# Altium schematic sheet PDC_high_Current_Outputs.SchDoc
size A
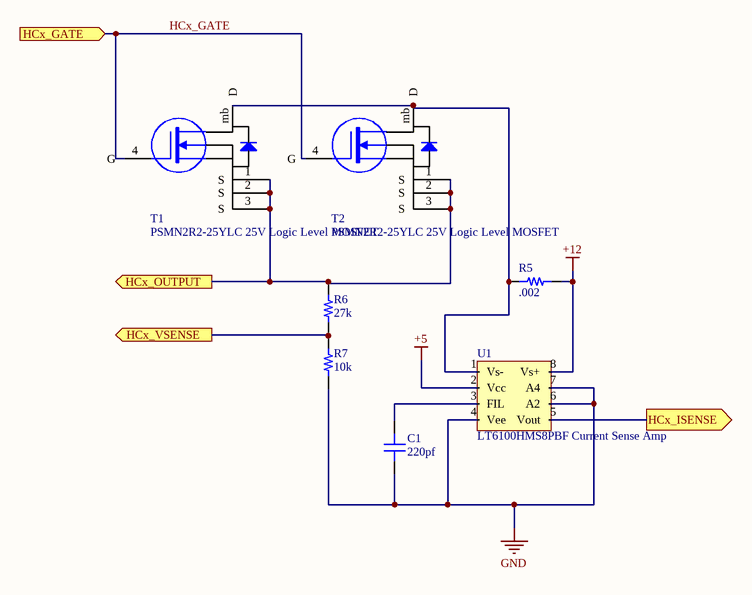
[diagram p0: PDC_high_Current_Outputs.SchDoc]

## Parts
C1  value 220pf  [CAP 0402/1005]  (hidden comment: Capacitor MLCC 220pf 16V CAP 0402/1005)
R5  value .002  [RES 2010/5025]  (hidden comment: Resistor .002 2010 1.5W 1%)
R6  value 27k  [RES 0805/2012]  (hidden comment: Resistor 27k 0805 1/10W 10%)
R7  value 10k  [RES 0402/1005]  (hidden comment: Resistor 10k 0402 1/10W 1%)
T1  PSMN2R2-25YLC 25V Logic Level MOSFET  [LFPAK-SO8]
T2  PSMN2R2-25YLC 25V Logic Level MOSFET  [LFPAK-SO8]
U1  LT6100HMS8PBF Current Sense Amp  [MSOP-8]

## Ports
HCx_GATE (in), HCx_ISENSE (out), HCx_OUTPUT (out), HCx_VSENSE (out)

## Nets
+5: U1.2(Vcc)
+12: R5.2 U1.8(Vs+)
GND: C1.1 R7.1 U1.4(Vee) U1.6(A2) U1.7(A4)
HCx_GATE: T1.4(G) T2.4(G) ; port HCx_GATE
HCx_ISENSE: U1.5(Vout) ; port HCx_ISENSE
HCx_OUTPUT: R6.2 T1.1(S) T1.2(S) T1.3(S) T2.1(S) T2.2(S) T2.3(S) ; port HCx_OUTPUT
HCx_VSENSE: R6.1 R7.2 ; port HCx_VSENSE
NetC1_2: C1.2 U1.3(FIL)
NetR5_1: R5.1 T1.mb(D) T2.mb(D) U1.1(Vs-)

## Library data of the parts
C1 = 57: Manufacturer_id: 1; idCapacitor: 57; Name: Cap_220pf_16V_CAP 0402/1005; Dielectric: Ceramic; Created_By: Nick Mah; Drawer_id: 1; Voltage_Rating: 16V; Package: CAP 0402/1005; Created_Date: 10/20/2018
R5 = 2702: Current Sense Resistor; Manufacturer_id: 1; MfrPartNo: CSNL2010FT2L00; idResistor: 2702; Name: Res_.002_2010_1.5W_1%; Created_By: Angel; Supplier 1: Digi-Key; Supplier Part Number 1: Digi-Key; Drawer_id: 1; Tolerance: 1%; Power: 1.5W; Package: 2010; Link: https://www.digikey.com/product-detail/en/stackpole-electronics-inc/CSNL2010FT2L00/CSNL2010FT2L00CT-ND/1788126; ComponentLink1Description: Datasheet
R6 = 2430: Manufacturer_id: 1; idResistor: 2430; Name: Res_27k_0805_1/10W_10%; Created_By: Nick Mah; Supplier 1: Digi-Key; Drawer_id: 1; Tolerance: 10%; Power: 1/10W; Package: 0805; ComponentLink1Description: Datasheet; Created_Date: 2018-10-20
R7 = 97: Manufacturer_id: 1; idResistor: 97; Name: Res_10k_0402_1/10W_1%; Created_By: Nick Mah; Supplier 1: Digi-Key; Drawer_id: 1; Tolerance: 1%; Power: 1/10W; Package: 0402; ComponentLink1Description: Datasheet; Created_Date: 2018-10-20
T1 T2 = 3: N-Channel 25V 100A (Tc) 106W (Tc) Surface Mount LFPAK56, Power-SO8; Manufacturer_id: 6; MfrPartNo: PSMN2R2-25YLC,115; idFETs: 3; Drawer_id: 1; Value: N_Channel; Rds_On: 2.5mOhm; Vgs(typ): 10V; Vgs(Max): 20V; Created_By: Nick; Name: PSMN2R2; Vdss: 25V; Num_Circuits: 1; Id: 100A; Package: LFPAK-SO8; Link: https://www.digikey.com/product-detail/en/nexperia-usa-inc/PSMN2R2-25YLC115/1727-5299-1-ND/2674299; ComponentLink1Description: Datasheet; ComponentLink1URL: https://assets.nexperia.com/documents/data-sheet/PSMN2R2-25YLC.pdf; Supplier1: Digi-Key; Supplier1PartNo: 1727-5299-1-ND
U1 = 13: Manufacturer_id: 1; idIC_Misc: 13; Name: LT6100 Current Sense Amp; Created_By: Eddy; Drawer_id: 1; Package: MS8; Created_Date: 10/17/2018